# EAGLE schematic MKRZero_V5.0 (EAGLE 7.6.0)

## Sheet 1 of 2
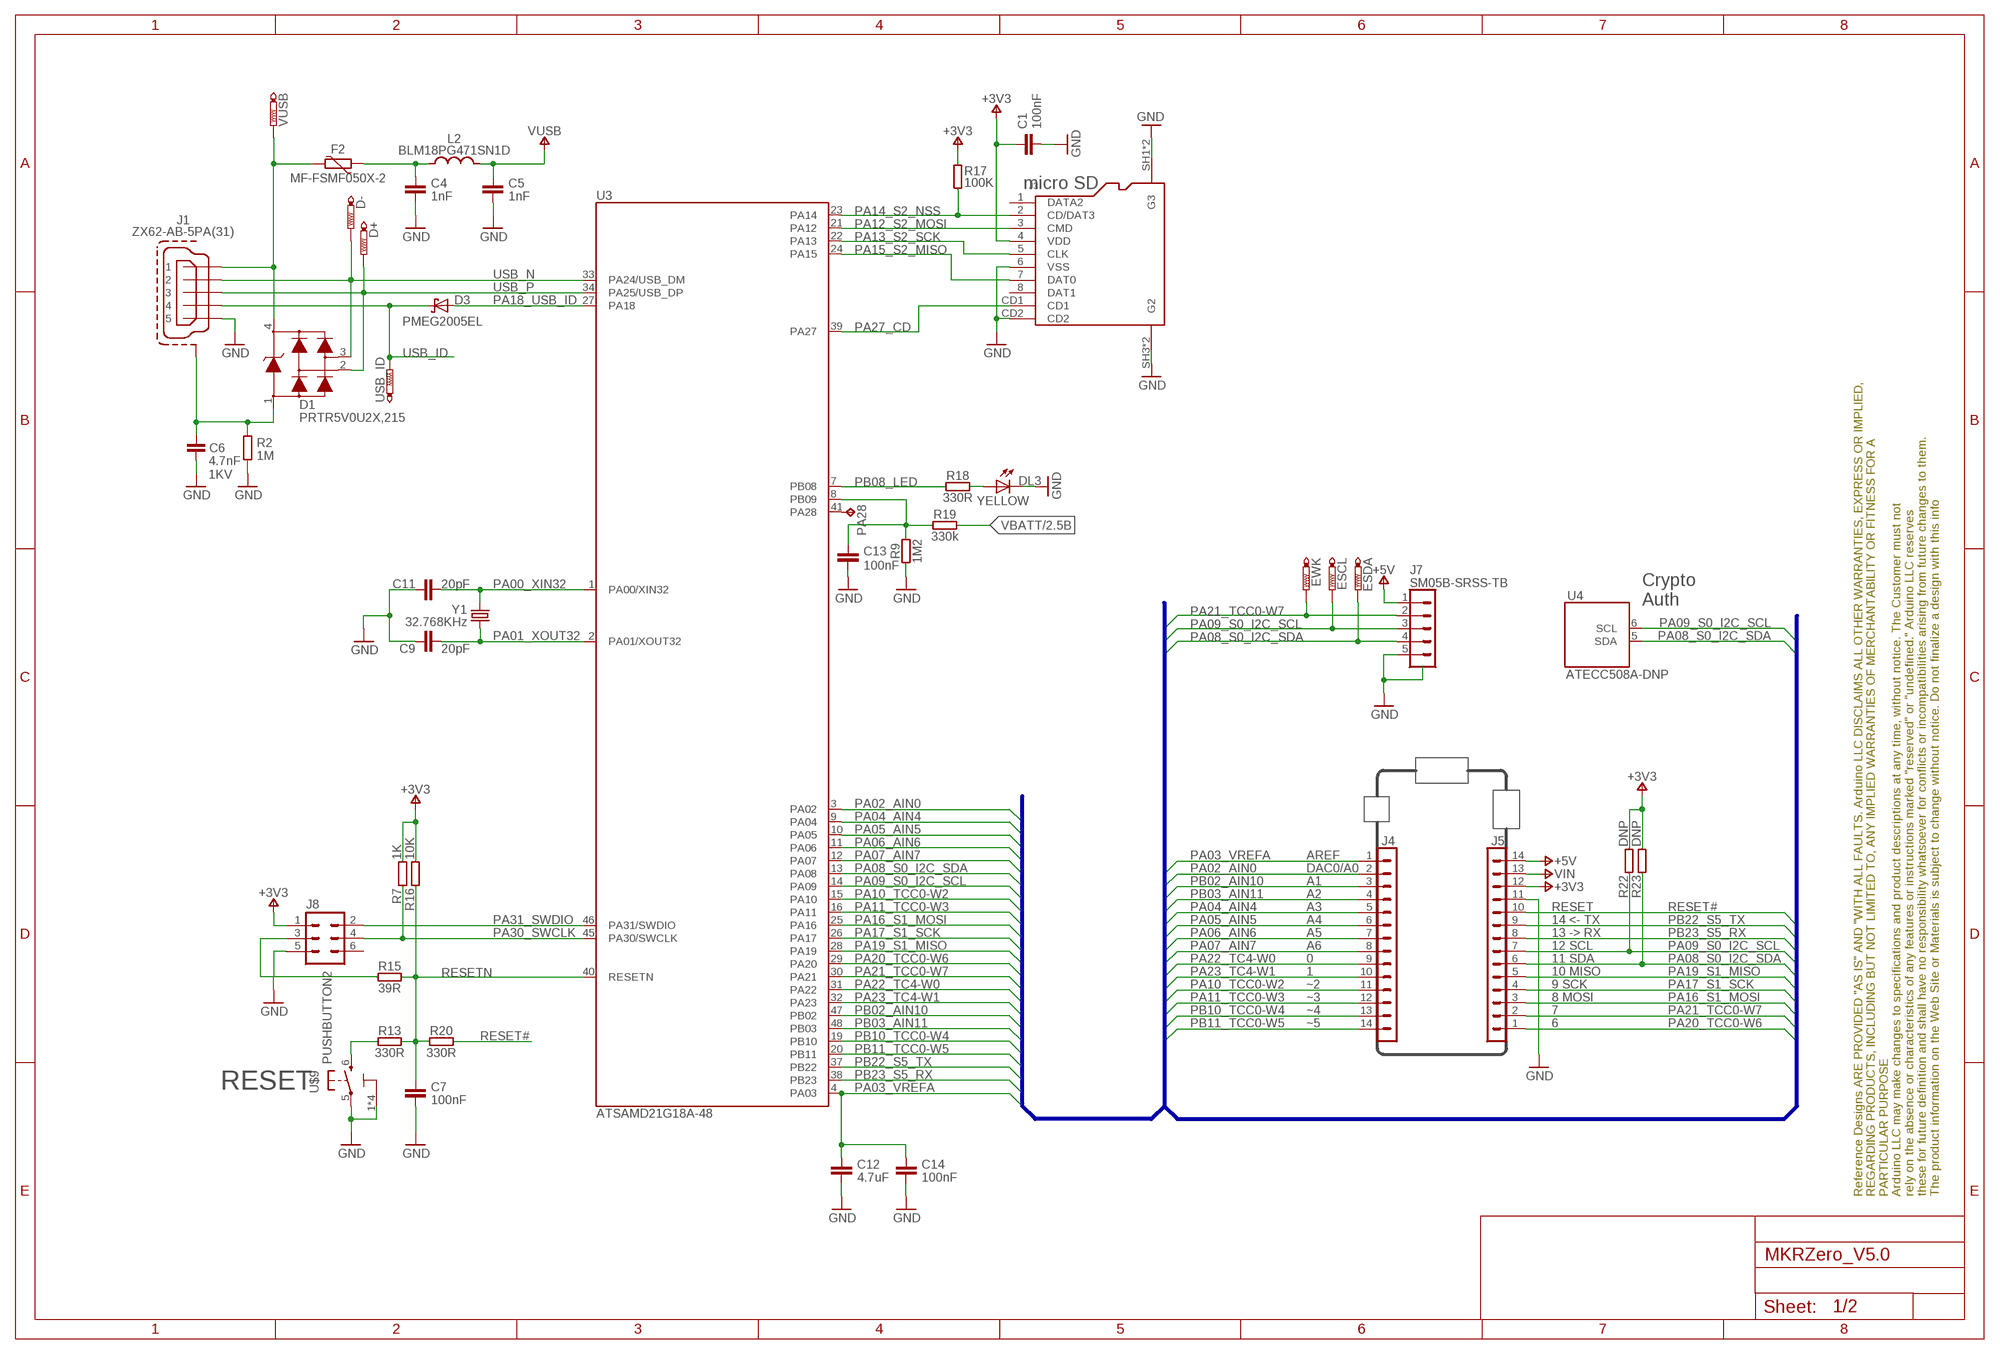
[diagram p0: schematic, sheet 1]

### Parts
C1  100nF  C-100NF-0402  [0402-1005X55N]
C4  1nF  C-10NF-0402  [0402-1005X55N]
C5  1nF  C-100NF-0402  [0402-1005X55N]
C6  4.7nF  CAPACITORS-0805  [C0805]
C7  100nF  C-100NF-0402  [0402-1005X55N]
C9  20pF  C-20PF-0402  [0402-1005X55N]
C11  20pF  C-20PF-0402  [0402-1005X55N]
C12  4.7uF  C-4.7UF-0402  [0402-1005X55N]
C13  100nF  C-100NF-0402  [0402-1005X55N]
C14  100nF  C-100NF-0402  [0402-1005X55N]
D1  PRTR5V0U2X,215  [SOT190P230X110-4N]
D3  PMEG2005EL  [SODFL1008X40N-882D]
D+  PTR1B1,27  [B1,27]
D-  PTR1B1,27  [B1,27]
DL3  YELLOW  LED-GREEN-0603  [LEDC1608X80N-AK]
ESCL  PTR1B1,27  [B1,27]
ESDA  PTR1B1,27  [B1,27]
EWK  PTR1B1,27  [B1,27]
F2  MF-FSMF050X-2  [0603-F1608X100N]
FRAME1  Page 1  A3L-LOC  [FRAME]
J1  ZX62-AB-5PA(31)  ZX62AB-5PA(11)  [USBMICRO-ZX62-AB-5PA]
J3  AMPHENOL_114-00841-68  [AMPHENOL_114-00841-68]
J4  DNP  STRIP-14  [STRIP-14-MODULI-A11]
J5  DNP  STRIP-14  [STRIP-14-MODULI-A11]
J7  SM05B-SRSS-TB  [SM05B-SRSS-TB]
J8  2X3_SMD_MALE  [2X3_SMT]
L2  BLM18PG471SN1D  [0603-1608X90N]
PA28  TPB2,54  [B2,54]
R2  1M  R-1M-0402  [0402-1005X55N]
R7  1K  R-1K-0402  [0402-1005X55N]
R9  1M2  R-330R-0402  [0402-1005X55N]
R13  330R  R-330R-0402  [0402-1005X55N]
R15  39R  R-39R-0402  [0402-1005X55N]
R16  10K  R-10K-0402  [0402-1005X55N]
R17  100K  R-100K-0402  [0402-1005X55N]
R18  330R  R-330R-0402  [0402-1005X55N]
R19  330k  R-330R-0402  [0402-1005X55N]
R20  330R  R-330R-0402  [0402-1005X55N]
R22  DNP  R-4K7-0402  [0402-1005X55N]
R23  DNP  R-4K7-0402  [0402-1005X55N]
U3  ATSAMD21G18A-48  [QFN50P700X700X90-49XN-EPSQ515]
U4  ATECC508A-DNP  ATECC508A-MAHDA-T  [SON50P300X200X60-9N-EP160X140]
U$9  PUSHBUTTON2  [C&K_PTS820_NOPEGS]
USB_ID  PTR1B1,27  [B1,27]
VUSB  PTR1B1,27  [B1,27]
Y1  32.768KHz  ABS07-32.768KHZ-T  [QUARZO-ABS07]

### Nets
+3V3: C1.1 J3.4(VDD) J5.12 J8.1 R7.2 R16.2 R17.2 R22.2 R23.2 ; also sheet 2
+5V: J5.14 J7.1 ; also sheet 2
GND: C1.2 C4.2 C5.2 C6.2 C7.2 C9.1 C11.1 C12.2 C13.2 C14.2 DL3.C J1.5 J3.6(VSS) J3.CD2 J3.SH1(G3) J3.SH2(G3) J3.SH3(G2) J3.SH4(G2) J5.11 J7.5 J7.SH1(SH) J7.SH2(SH) J8.5 R2.1 R9.1 U$9.1 U$9.2 U$9.3 U$9.4 U$9.5 ; also sheet 2
N17650912: D1.4 F2.2 J1.1 VUSB.PP(TP)
N17658775: R13.1 U$9.6
N$1: C6.1 D1.1 J1.6(SH) J1.7(SH) J1.8(SH) J1.9(SH) J1.10(SH) J1.11(SH) R2.2
N$2: C4.1 F2.1 L2.1
N$4: J8.3 R15.1
N$5: PA28.PP(TP) U3.41(PA28)
N$6: C13.1 R9.2 R19.1 U3.8(PB09)
N$7: DL3.A R18.2
PA00_XIN32: C11.2 U3.1(PA00/XIN32) Y1.2
PA01_XOUT32: C9.2 U3.2(PA01/XOUT32) Y1.1
PA02_AIN0: J4.2 U3.3(PA02)
PA03_VREFA: C12.1 C14.1 J4.1 U3.4(PA03)
PA04_AIN4: J4.5 U3.9(PA04)
PA05_AIN5: J4.6 U3.10(PA05)
PA06_AIN6: J4.7 U3.11(PA06)
PA07_AIN7: J4.8 U3.12(PA07)
PA08_S0_I2C_SDA: ESDA.PP(TP) J5.6 J7.4 R23.1 U3.13(PA08) U4.5(SDA)
PA09_S0_I2C_SCL: ESCL.PP(TP) J5.7 J7.3 R22.1 U3.14(PA09) U4.6(SCL)
PA10_TCC0-W2: J4.11 U3.15(PA10)
PA11_TCC0-W3: J4.12 U3.16(PA11)
PA12_S2_MOSI: J3.3(CMD) U3.21(PA12)
PA13_S2_SCK: J3.5(CLK) U3.22(PA13)
PA14_S2_NSS: J3.2(CD/DAT3) R17.1 U3.23(PA14)
PA15_S2_MISO: J3.7(DAT0) U3.24(PA15)
PA16_S1_MOSI: J5.3 U3.25(PA16)
PA17_S1_SCK: J5.4 U3.26(PA17)
PA18_USB_ID: D3.A U3.27(PA18)
PA19_S1_MISO: J5.5 U3.28(PA19)
PA20_TCC0-W6: J5.1 U3.29(PA20)
PA21_TCC0-W7: EWK.PP(TP) J5.2 J7.2 U3.30(PA21)
PA22_TC4-W0: J4.9 U3.31(PA22)
PA23_TC4-W1: J4.10 U3.32(PA23)
PA27_CD: J3.CD1 U3.39(PA27)
PA30_SWCLK: J8.4 R7.1 U3.45(PA30/SWCLK)
PA31_SWDIO: J8.2 U3.46(PA31/SWDIO)
PB02_AIN10: J4.3 U3.47(PB02)
PB03_AIN11: J4.4 U3.48(PB03)
PB08_LED: R18.1 U3.7(PB08)
PB10_TCC0-W4: J4.13 U3.19(PB10)
PB11_TCC0-W5: J4.14 U3.20(PB11)
PB22_S5_TX: J5.9 U3.37(PB22)
PB23_S5_RX: J5.8 U3.38(PB23)
RESET#: J5.10 R20.2
RESETN: C7.1 R13.2 R15.2 R16.1 R20.1 U3.40(RESETN)
USB_ID: D3.C J1.4 USB_ID.PP(TP) ; also sheet 2
USB_N: D1.3 D-.PP(TP) J1.2 U3.33(PA24/USB_DM)
USB_P: D1.2 D+.PP(TP) J1.3 U3.34(PA25/USB_DP)
VBATT: R19.2 ; also sheet 2
VIN: J5.13 ; also sheet 2
VUSB: C5.1 L2.2 ; also sheet 2
Unconnected: J3.1(DATA2) J3.8(DAT1) J8.6

### Buses
PA03_VREFA,PA02_AIN0,PB02_AIN10,PB03_AIN11,PA04_AIN4,PA05_AIN5,PA06_AIN6,PA07_AIN7,PA22_TC4-W0,PA23_TC4-W1,PA10_TCC0-W2,PA11_TCC0-W3,PB10_TCC0-W4,PB11_TCC0-W5,PA20_TCC0-W6,PA21_TCC0-W7,PA16_S1_MOSI,PA17_S1_SCK,PA19_S1_MISO,PA08_S0_I2C_SDA,PA09_S0_I2C_SCL,PB23_S5_RX,PB22_S5_TX,RESET#

### Notes on the sheet
- micro SD
- Crypto
  Auth
- AREF
- DAC0/A0
- A1
- A2
- A3 | RESET
- A4 | 14 <- TX
- A5 | 13 -> RX
- A6 | 12 SCL
- 0 | 11 SDA
- 1 | 10 MISO
- ~2 | 9 SCK
- ~3 | 8 MOSI
- ~4 | 7
- ~5 | 6
- RESET

## Sheet 2 of 2
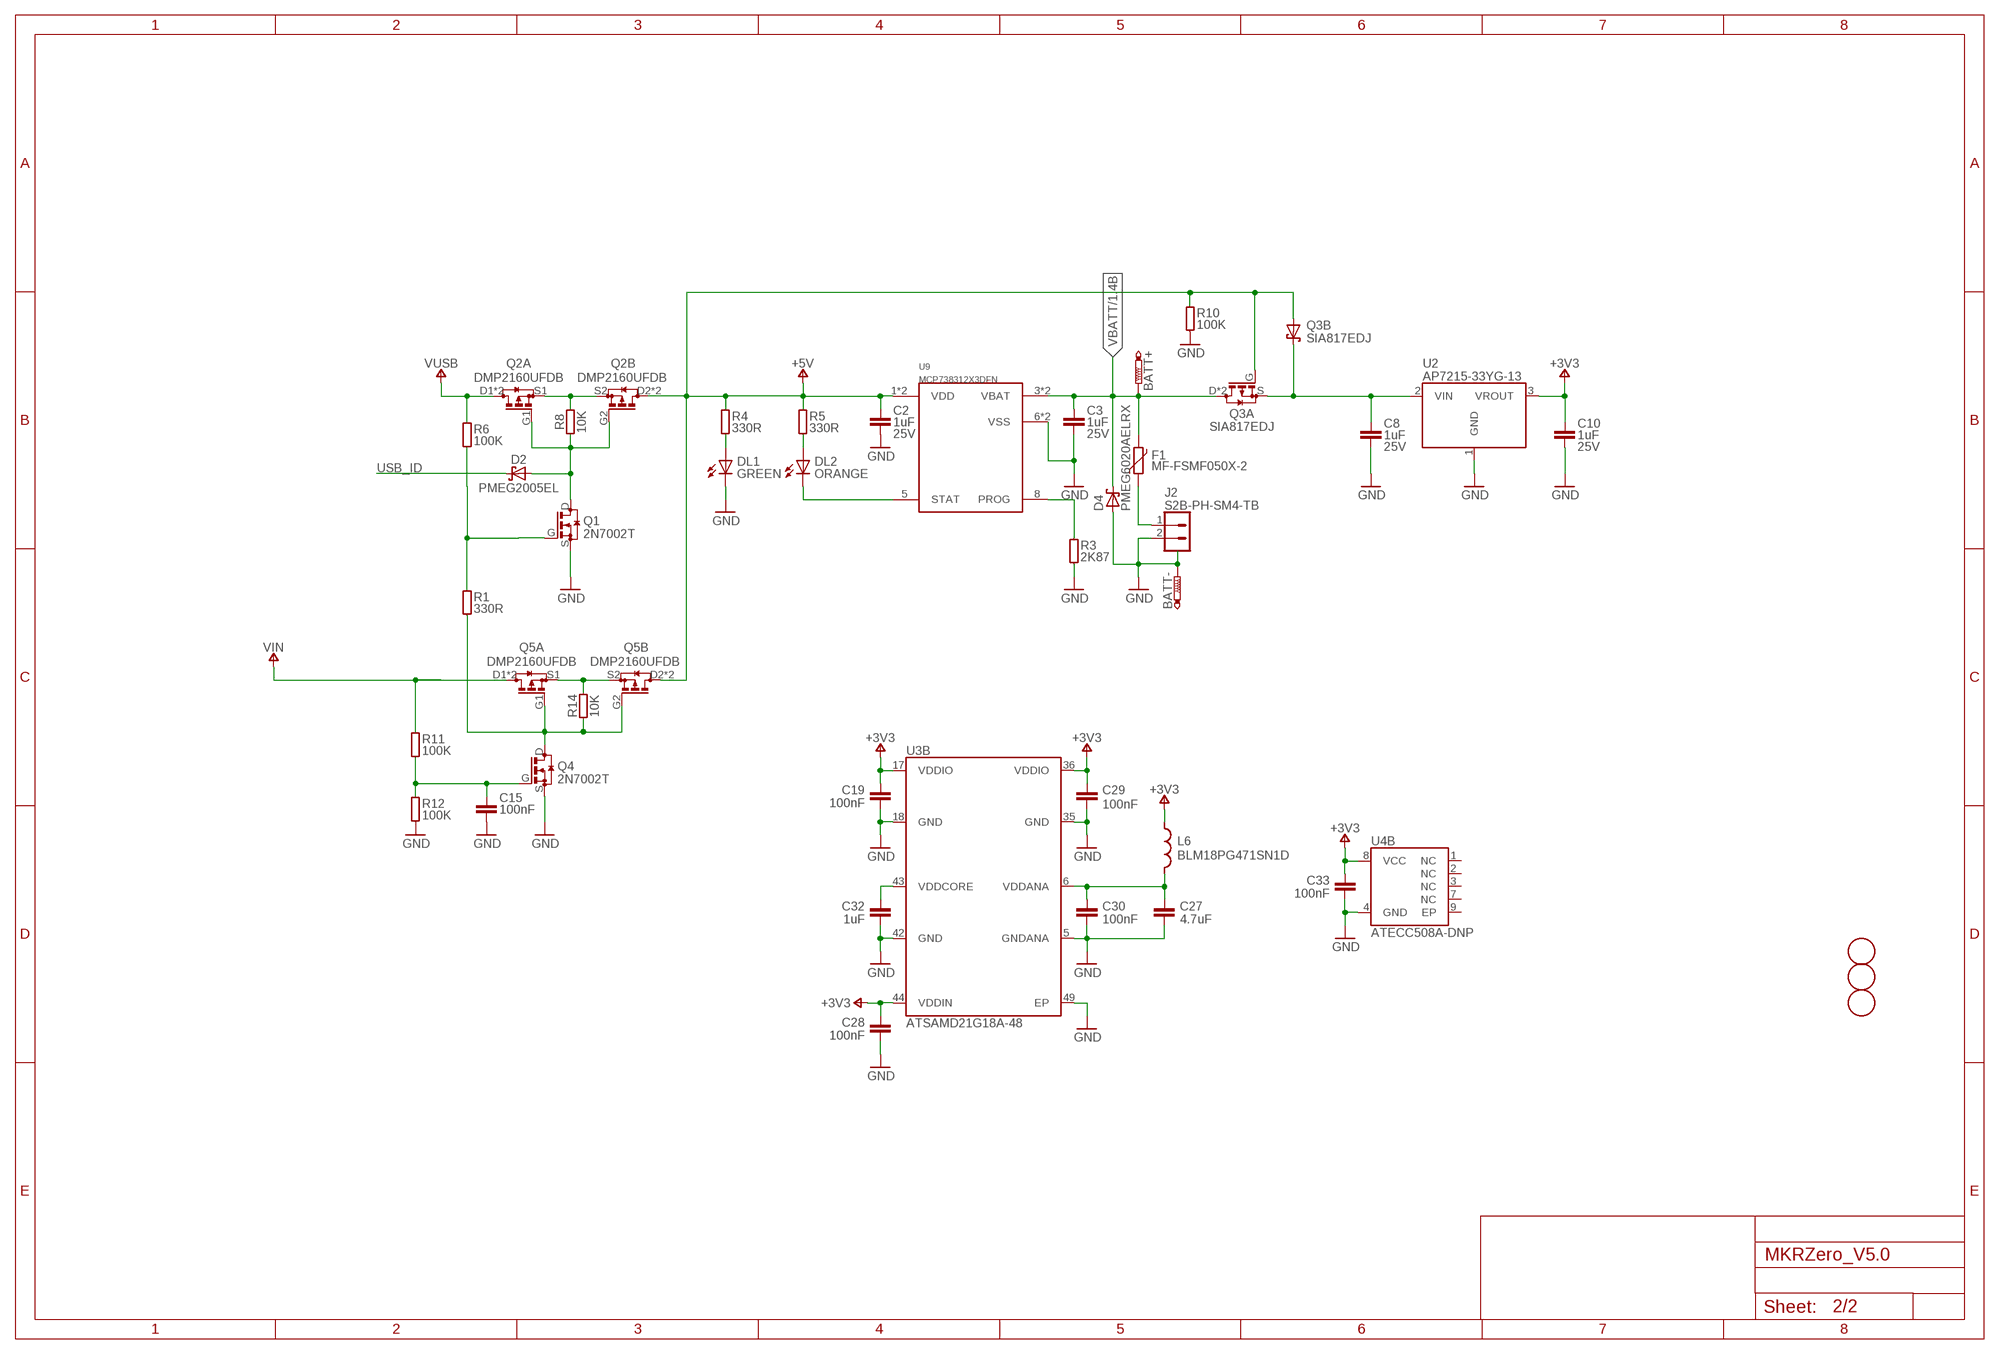
[diagram p1: schematic, sheet 2]

### Parts
BATT+  PTR1B1,27  [B1,27]
BATT-  PTR1B1,27  [B1,27]
C2  1uF  C-1UF-0402  [0402-1005X55N]
C3  1uF  C-1UF-0402  [0402-1005X55N]
C8  1uF  C-1UF-0402  [0402-1005X55N]
C10  1uF  C-1UF-0402  [0402-1005X55N]
C15  100nF  C-1UF-0402  [0402-1005X55N]
C19  100nF  C-100NF-0402  [0402-1005X55N]
C27  4.7uF  C-4.7UF-0402  [0402-1005X55N]
C28  100nF  C-100NF-0402  [0402-1005X55N]
C29  100nF  C-100NF-0402  [0402-1005X55N]
C30  100nF  C-100NF-0402  [0402-1005X55N]
C32  1uF  C-1UF-0402  [0402-1005X55N]
C33  100nF  C-100NF-0402  [0402-1005X55N]
D2  PMEG2005EL  [SODFL1008X40N-882D]
D4  PMEG6020AELRX  D_SCHOTTKYSO123  [SMA_DO123]
DL1  GREEN  LED-GREEN-0603  [LEDC1608X80N-AK]
DL2  ORANGE  LED-ORANGE-0603  [LEDC1608X80N-AK]
F1  MF-FSMF050X-2  [0603-F1608X100N]
FD1  FIDUCIALMOUNT  [FIDUCIAL-MOUNT]
FD2  FIDUCIALMOUNT  [FIDUCIAL-MOUNT]
FD3  FIDUCIALMOUNT  [FIDUCIAL-MOUNT]
J2  S2B-PH-SM4-TB  [JST-S2B-PH-SM4-TB]
L6  BLM18PG471SN1D  [0603-1608X90N]
Q1  2N7002T  [SOTFL50P160X78-3]
Q2  DMP2160UFDB  [SON65P200X200X60-8N-DM]
Q3  SIA817EDJ  [SON65P205X205X75-8N-MWSD]
Q4  2N7002T  [SOTFL50P160X78-3]
Q5  DMP2160UFDB  [SON65P200X200X60-8N-DM]
R1  330R  R-330R-0402  [0402-1005X55N]
R3  2K87  R-2K87-0402  [0402-1005X55N]
R4  330R  R-330R-0402  [0402-1005X55N]
R5  330R  R-330R-0402  [0402-1005X55N]
R6  100K  R-100K-0402  [0402-1005X55N]
R8  10K  R-10K-0402  [0402-1005X55N]
R10  100K  R-100K-0402  [0402-1005X55N]
R11  100K  R-100K-0402  [0402-1005X55N]
R12  100K  R-100K-0402  [0402-1005X55N]
R14  10K  R-10K-0402  [0402-1005X55N]
U2  AP7215-33YG-13  [SOT150P400X160-3N]
U9  MCP738312X3DFN  [2X3DFN]

### Nets
+3V3: C10.1 C19.1 C28.1 C29.1 C33.1 L6.1 U2.3(VROUT) U3.17(VDDIO) U3.36(VDDIO) U3.44(VDDIN) U4.8(VCC) ; also sheet 1
+5V: C2.1 Q2.D2'(B:D) Q2.D2(B:D) Q3.A(B:A) Q3.G(A:G) Q5.D2'(B:D) Q5.D2(B:D) R4.2 R5.2 R10.2 U9.1(VDD) U9.2(VDD) ; also sheet 1
GND: BATT-.PP(TP) C2.2 C3.2 C8.2 C10.2 C15.2 C19.2 C27.2 C28.2 C29.2 C30.2 C32.2 C33.2 D4.A DL1.C J2.2 J2.3(SH) J2.4(SH) Q1.S Q4.S R3.1 R10.1 R12.1 U2.1(GND) U3.5(GNDANA) U3.18(GND) U3.35(GND) U3.42(GND) U3.49(EP) U4.4(GND) U9.6(VSS) U9.PAD(VSS) ; also sheet 1
N17690335: Q2.S1(A:S) Q2.S2(B:S) R8.2
N17690346: D2.A Q1.D Q2.G1(A:G) Q2.G2(B:G) R8.1
N17690381: Q1.G R1.2 R6.1
N17690821: Q5.S1(A:S) Q5.S2(B:S) R14.2
N17690840: Q4.D Q5.G1(A:G) Q5.G2(B:G) R1.1 R14.1
N17690878: C15.1 Q4.G R11.1 R12.2
N17792230: R3.2 U9.8(PROG)
N17798864: DL2.A R5.1
N17834267: DL1.A R4.1
N17852357: C27.1 C30.1 L6.2 U3.6(VDDANA)
N17852431: C32.1 U3.43(VDDCORE)
N$3: F1.1 J2.1
STAT: DL2.C U9.5(STAT)
USB_ID: D2.C ; also sheet 1
VBATT: BATT+.PP(TP) C3.1 D4.C F1.2 Q3.D2(A:D) Q3.D(A:D) U9.3(VBAT) U9.4(VBAT) ; also sheet 1
VIN: Q5.D1'(A:D) Q5.D1(A:D) R11.2 ; also sheet 1
VLDO: C8.1 Q3.K2(B:C) Q3.K(B:C) Q3.S(A:S) U2.2(VIN)
VUSB: Q2.D1'(A:D) Q2.D1(A:D) R6.2 ; also sheet 1
Unconnected: U4.1(NC) U4.2(NC) U4.3(NC) U4.7(NC) U4.9(EP)

## Library data of the parts
BATT+ BATT- D+ D- ESCL ESDA EWK USB_ID VUSB = testpad:PTR1: TEST PIN
C1 C5 C7 C13 C14 C19 C28-C30 C33 = MK1_Zero:C: Capacitor; DESCR: CAP CER 0.1UF 50V 10% X5R 0402; MF: TDK; MPN: C1005X5R1H104K050BB
C2 C3 C8 C10 C15 = MK1_Zero:C: Capacitor; DESCR: CAP CER 1UF 25V 10% X5R 0402; MF: Murata; MPN: GRM155R61E105KA12D; VOLTAGE: 25V
C4 = MK1_Zero:C: Capacitor; DESCR: CAP CER 10NF 50V 10% X7R 0402; MF: Murata; MPN: GRM155R71H103KA88J
C6 = Arduino-rcl:CAPACITORS: Capacitors ...4.7uF @ 6.3V -> 0402 ...10uF @ 16V -> 0603 ...22uF @ 25V -> 0805; VOLTAGE: 1KV
C9 C11 = MK1_Zero:C: Capacitor; DESCR: CAP CER 20PF 50V 5% NP0 0402; MF: Kemet; MPN: CBR04C200J5GAC
C12 C27 = MK1_Zero:C: Capacitor; DESCR: CAP CER 4.7UF 6.3V 20% X5R 0402; MF: Murata; MPN: GRM155R60J475ME47D
C32 = MK1_Zero:C: Capacitor; DESCR: CAP CER 1UF 25V 10% X5R 0402; MF: Murata; MPN: GRM155R61E105KA12D
D1 = MK1_Zero:PRTR5V0U2X,215; DESCR: TVS DIODE 5.5VWM SOT143B; MF: NXP; MPN: PRTR5V0U2X,215
D2 D3 = MK1_Zero:PMEG2005EL: DIODE SCHOTTKY 20V 500MA SOD882; DESCR: DIODE SCHOTTKY 20V 500MA SOD882; MF: NXP; MPN: PMEG2005EL,315
D4 = Arduino-diodes:D_SCHOTTKY: Schottky Diodes
DL1 DL3 = MK1_Zero:LED: LED; DESCR: LED GREEN DIFFUSED 0603 SMD; MF: Avago; MPN: HSMG-C190
DL2 = MK1_Zero:LED: LED; DESCR: LED ORANGE DIFFUSED 0603 SMD; MF: Avago; MPN: HSMD-C190
F1 F2 = MK1_Zero:MF-FSMF050X-2: FUSE PTC RESET 500MA SMD 0603; DESCR: FUSE PTC RESET 500MA SMD 0603; MF: Bourns Inc; MPN: MF-FSMF050X-2
FD1-FD3 = Arduino-utility:FIDUCIALMOUNT
FRAME1 = Arduino-utility:A3L-LOC: FRAME DIN A3, landscape with location and doc. field
J1 = MK1_Zero:ZX62AB-5PA(11)
J2 = MK1_Zero:S2B-PH-SM4-TB: CONN HEADER PH SIDE 2POS 2MM SMD; DESCR: CONN HEADER PH SIDE 2POS 2MM SMD; MF: JST; MPN: S2B-PH-SM4-TB(LF)(SN)
J3 = Arduino-connectors:AMPHENOL_114-00841-68
J4 J5 = MK1_Zero:STRIP-14
J7 = MK1_Zero:SM05B-SRSS-TB: CONN HEADER SH 5POS SIDE 1MM TIN Datasheet <http://www.jst-mfg.com/product/pdf/eng/eSH.pdf>; DESCR: CONN HEADER SH 5POS SIDE 1MM TIN; MF: JST; MPN: SM05B-SRSS-TB
J8 = MK1_Zero:2X3_SMD_MALE
L2 L6 = MK1_Zero:BLM18PG471SN1D: FERRITE CHIP 470 OHM 1000MA 0603
PA28 = testpad:TP: Test pad
Q1 Q4 = MK1_Zero:2N7002T: MOSFET N-CH 60V 115MA SOT-523F; DESCR: MOSFET N-CH 60V 115MA SOT-523F; MF: Fairchild; MPN: 2N7002T
Q2 Q5 = MK1_Zero:DMP2160UFDB: MOSFET 2P-CH 20V 3.8A 6UDFN; DESCR: MOSFET 2P-CH 20V 3.8A 6UDFN; MF: Diodes Inc; MPN: DMP2160UFDB-7
Q3 = MK1_Zero:SIA817EDJ: MOSFET P-CH 30V 4.5A SC-70-6; DESCR: MOSFET P-CH 30V 4.5A SC-70-6; MF: Vishay; MPN: SIA817EDJ-T1-GE3
R1 R4 R5 R9 R13 R18-R20 = MK1_Zero:R: Resistor; DESCR: RES 330 OHM 1/16W 1% 0402 SMD; MF: Yageo; MPN: RC0402FR-07330RL
R2 = MK1_Zero:R: Resistor; DESCR: RES 1M OHM 1/16W 1% 0402; MF: Yageo; MPN: RC0402FR-071ML
R3 = MK1_Zero:R: Resistor; DESCR: RES SMD 2.87K OHM 1% 1/16W 0402; MF: Yageo; MPN: RC0402FR-072K87L
R6 R10-R12 R17 = MK1_Zero:R: Resistor; DESCR: RES 100K OHM 1/16W 1% 0402 SMD; MF: Yageo; MPN: RC0402FR-07100KL
R7 = MK1_Zero:R: Resistor; DESCR: RES SMD 1K OHM 1% 1/16W 0402; MF: Yageo; MPN: RC0402FR-071KL
R8 R14 R16 = MK1_Zero:R: Resistor; DESCR: RES SMD 10K OHM 1% 1/16W 0402; MF: Yageo; MPN: RC0402FR-0710KL
R15 = MK1_Zero:R: Resistor; DESCR: RES 39.0 OHM 1/16W 1% 0402 SMD; MF: Yageo; MPN: RC0402FR-0739RL
R22 R23 = MK1_Zero:R: Resistor; DESCR: RES 4.7K OHM 1/16W 1% 0402 SMD; MF: Yageo; MPN: RC0402FR-074K7L
U2 = MK1_Zero:AP7215-33YG-13: IC REG LDO 3.3V 0.6A SOT89-3 Datasheet <http://www.diodes.com/_files/datasheets/AP7215.pdf>; DESCR: IC REG LDO 3.3V 0.6A SOT89-3; MF: Diodes Inc; MPN: AP7215-33YG-13
U3 = MK1_Zero:ATSAMD21G18A-48: IC MCU 32BIT 256KB FLASH 48QFN Datasheet (Summary) <http://www.atmel.com/Images/Atmel-42181-SAM-D21_Summary.pdf> Datasheet (Complete) <http://www.atmel.com/Images/Atmel-42181-SAM-D21_Datasheet.pdf>; DESCR: IC MCU 32BIT 256KB FLASH 48QFN; MF: Atmel; MPN: ATSAMD21E18A-MU
U4 = MK1_Zero:ATECC508A-MAHDA-T: IC CRYPTO ECC 8KB 8-UDFN I2C; DESCR: IC CRYPTO ECC 8KB 8-UDFN I2C; MF: Atmel; MPN: ATECC508A-MAHDA-T
U9 = Arduino-ICs:MCP73831
U$9 = Arduino-pushbuttons:PUSHBUTTON2: TS42 Dongnan Electronics Tact switch VDC 12V - 50mA
Y1 = MK1_Zero:ABS07-32.768KHZ-T; DESCR: CRYSTAL 32.768KHZ 12.5PF SMD 3.2x1.5mm; MF: Abracon; MPN: ABS07-32.768KHZ-T

## Net classes
0 default: width 0.25 mm, drill 0.25 mm